# Altium project 100861_project.prjpcb
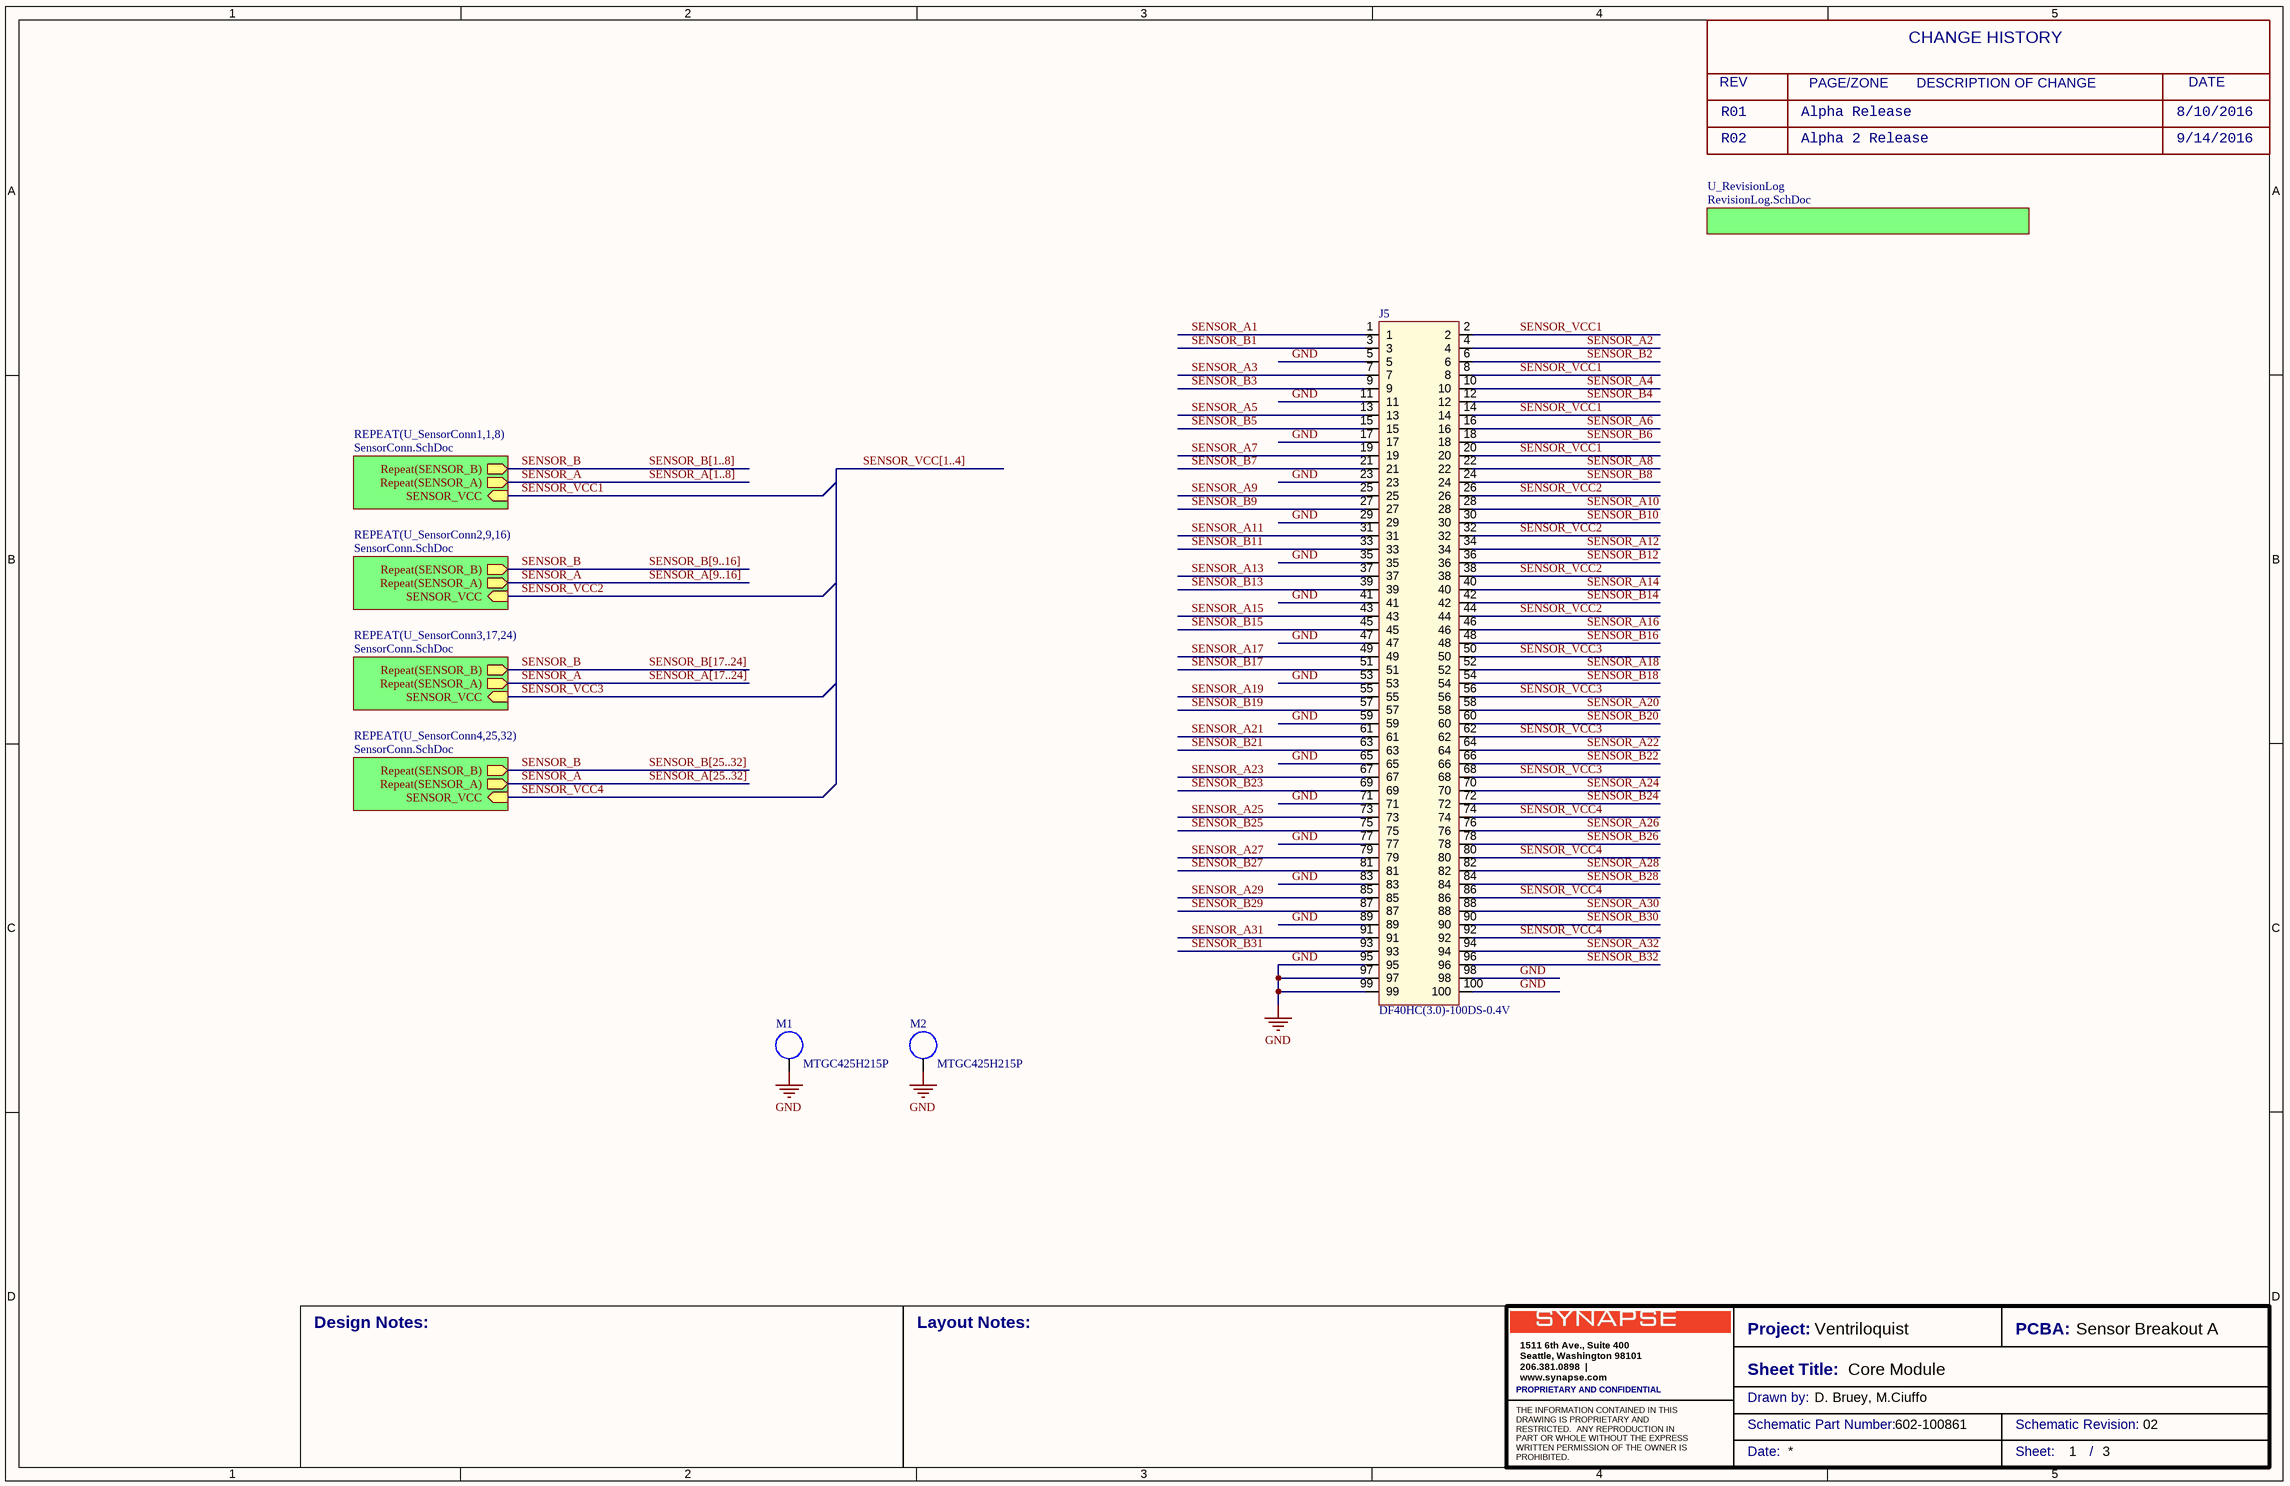
[diagram p0: SensorBreakout.SchDoc]
Board_Name: Sensor Breakout A; Board_Number: 100861; PCB_Revision: 02; Project_Name: Ventriloquist; Sch_Revision: 02
3 sheets, 99 parts. Net scope: hierarchical (ports join the sheet entries above them; power ports are global).
Board file: 100861.PcbDoc
Sheets:
  SensorBreakout.SchDoc
    U_SensorConn11 = SensorConn.SchDoc
    U_SensorConn12 = SensorConn.SchDoc
    U_SensorConn13 = SensorConn.SchDoc
    U_SensorConn14 = SensorConn.SchDoc
    U_SensorConn15 = SensorConn.SchDoc
    U_SensorConn16 = SensorConn.SchDoc
    U_SensorConn17 = SensorConn.SchDoc
    U_SensorConn18 = SensorConn.SchDoc
    U_SensorConn29 = SensorConn.SchDoc
    U_SensorConn210 = SensorConn.SchDoc
    U_SensorConn211 = SensorConn.SchDoc
    U_SensorConn212 = SensorConn.SchDoc
    U_SensorConn213 = SensorConn.SchDoc
    U_SensorConn214 = SensorConn.SchDoc
    U_SensorConn215 = SensorConn.SchDoc
    U_SensorConn216 = SensorConn.SchDoc
    U_SensorConn317 = SensorConn.SchDoc
    U_SensorConn318 = SensorConn.SchDoc
    U_SensorConn319 = SensorConn.SchDoc
    U_SensorConn320 = SensorConn.SchDoc
    U_SensorConn321 = SensorConn.SchDoc
    U_SensorConn322 = SensorConn.SchDoc
    U_SensorConn323 = SensorConn.SchDoc
    U_SensorConn324 = SensorConn.SchDoc
    U_SensorConn425 = SensorConn.SchDoc
    U_SensorConn426 = SensorConn.SchDoc
    U_SensorConn427 = SensorConn.SchDoc
    U_SensorConn428 = SensorConn.SchDoc
    U_SensorConn429 = SensorConn.SchDoc
    U_SensorConn430 = SensorConn.SchDoc
    U_SensorConn431 = SensorConn.SchDoc
    U_SensorConn432 = SensorConn.SchDoc
    U_RevisionLog = RevisionLog.SchDoc

## Sheet SensorBreakout.SchDoc: Core Module
size 431 x 279 mm; DrawnBy: D. Bruey, M.Ciuffo; Organization: Synapse Product Development, LLC.; Address1: 1511 6th Ave., Suite 400; Address2: Seattle, Washington 98101; Address3: 206.381.0898; Address4: www.synapse.com; DocumentNumber: 1; SheetNumber: 1; SheetTotal: 3; PageSetup: Record=PageOptions|CenterHorizontal=True|CenterVertical=True|PrintScale=1.06|XCorrection=1.00|YCorrection=1.00|PrintKind=1|BorderSize=5000000|LeftOffset=0|BottomOffset=0|Orientation=2|PaperLength=4318|PaperWidth=2794|Scale=100|PaperSource=7|PrintQuality=200|MediaType=1|DitherType=10|PrintScaleMode=1|PaperKind=11x17|PaperIndex=3

### Parts
J5  DF40HC(3.0)-100DS-0.4V  [con100_hirose-df40c-100ds_129h]
M1  MTGC425H215P  [MTGC425H215P]  (no BOM)
M2  MTGC425H215P  [MTGC425H215P]  (no BOM)

### Sub-sheets
REPEAT(U_SensorConn1,1,8) = SensorConn.SchDoc: Repeat(SENSOR_A), Repeat(SENSOR_B), SENSOR_VCC (in)
REPEAT(U_SensorConn2,9,16) = SensorConn.SchDoc: Repeat(SENSOR_A), Repeat(SENSOR_B), SENSOR_VCC (in)
REPEAT(U_SensorConn3,17,24) = SensorConn.SchDoc: Repeat(SENSOR_A), Repeat(SENSOR_B), SENSOR_VCC (in)
REPEAT(U_SensorConn4,25,32) = SensorConn.SchDoc: Repeat(SENSOR_A), Repeat(SENSOR_B), SENSOR_VCC (in)
U_RevisionLog = RevisionLog.SchDoc: no entries

### Nets
GND: J5.5 J5.11 J5.17 J5.23 J5.29 J5.35 J5.41 J5.47 J5.53 J5.59 J5.65 J5.71 J5.77 J5.83 J5.89 J5.95 J5.97 J5.98 J5.99 J5.100 M1.1 M2.1
SENSOR_A: sheet REPEAT(U_SensorConn1,1,8)/Repeat(SENSOR_A), sheet REPEAT(U_SensorConn2,9,16)/Repeat(SENSOR_A), sheet REPEAT(U_SensorConn3,17,24)/Repeat(SENSOR_A), sheet REPEAT(U_SensorConn4,25,32)/Repeat(SENSOR_A)
SENSOR_A1: J5.1
SENSOR_A2: J5.4
SENSOR_A3: J5.7
SENSOR_A4: J5.10
SENSOR_A5: J5.13
SENSOR_A6: J5.16
SENSOR_A7: J5.19
SENSOR_A8: J5.22
SENSOR_A9: J5.25
SENSOR_A10: J5.28
SENSOR_A11: J5.31
SENSOR_A12: J5.34
SENSOR_A13: J5.37
SENSOR_A14: J5.40
SENSOR_A15: J5.43
SENSOR_A16: J5.46
SENSOR_A17: J5.49
SENSOR_A18: J5.52
SENSOR_A19: J5.55
SENSOR_A20: J5.58
SENSOR_A21: J5.61
SENSOR_A22: J5.64
SENSOR_A23: J5.67
SENSOR_A24: J5.70
SENSOR_A25: J5.73
SENSOR_A26: J5.76
SENSOR_A27: J5.79
SENSOR_A28: J5.82
SENSOR_A29: J5.85
SENSOR_A30: J5.88
SENSOR_A31: J5.91
SENSOR_A32: J5.94
SENSOR_B: sheet REPEAT(U_SensorConn1,1,8)/Repeat(SENSOR_B), sheet REPEAT(U_SensorConn2,9,16)/Repeat(SENSOR_B), sheet REPEAT(U_SensorConn3,17,24)/Repeat(SENSOR_B), sheet REPEAT(U_SensorConn4,25,32)/Repeat(SENSOR_B)
SENSOR_B1: J5.3
SENSOR_B2: J5.6
SENSOR_B3: J5.9
SENSOR_B4: J5.12
SENSOR_B5: J5.15
SENSOR_B6: J5.18
SENSOR_B7: J5.21
SENSOR_B8: J5.24
SENSOR_B9: J5.27
SENSOR_B10: J5.30
SENSOR_B11: J5.33
SENSOR_B12: J5.36
SENSOR_B13: J5.39
SENSOR_B14: J5.42
SENSOR_B15: J5.45
SENSOR_B16: J5.48
SENSOR_B17: J5.51
SENSOR_B18: J5.54
SENSOR_B19: J5.57
SENSOR_B20: J5.60
SENSOR_B21: J5.63
SENSOR_B22: J5.66
SENSOR_B23: J5.69
SENSOR_B24: J5.72
SENSOR_B25: J5.75
SENSOR_B26: J5.78
SENSOR_B27: J5.81
SENSOR_B28: J5.84
SENSOR_B29: J5.87
SENSOR_B30: J5.90
SENSOR_B31: J5.93
SENSOR_B32: J5.96
SENSOR_VCC1: J5.2 J5.8 J5.14 J5.20 ; sheet REPEAT(U_SensorConn1,1,8)/SENSOR_VCC
SENSOR_VCC2: J5.26 J5.32 J5.38 J5.44 ; sheet REPEAT(U_SensorConn2,9,16)/SENSOR_VCC
SENSOR_VCC3: J5.50 J5.56 J5.62 J5.68 ; sheet REPEAT(U_SensorConn3,17,24)/SENSOR_VCC
SENSOR_VCC4: J5.74 J5.80 J5.86 J5.92 ; sheet REPEAT(U_SensorConn4,25,32)/SENSOR_VCC

### Buses and harness runs
bus SENSOR_A[1..8]
bus SENSOR_A[9..16]
bus SENSOR_A[17..24]
bus SENSOR_A[25..32]
bus SENSOR_B[1..8]
bus SENSOR_B[9..16]
bus SENSOR_B[17..24]
bus SENSOR_B[25..32]
bus SENSOR_VCC[1..4]

### Notes on the sheet
- REV
- PAGE/ZONE       DESCRIPTION OF CHANGE
- CHANGE HISTORY
- DATE
- R01
- R02
- Alpha Release
- Alpha 2 Release
- 8/10/2016
- 9/14/2016
- Design Notes:
- Layout Notes:
- Project:
- Sheet Title:
- PCBA:
- PROPRIETARY AND CONFIDENTIAL
- Drawn by:
- Schematic Part Number:
- Schematic Revision:
- Date:
- Sheet:
- /

### Library data of the parts
J5 = DF40HC(3.0)-100DS-0.4V(51): CONN RCPT 100POS 0.4MM SMD GOLD 3.0MM; part_type: connector; id: 1590; mfg: Hirose; dist: Mouser; dist_pn: 798-DF40HC30100DS451; voltage: 30V; positions: 100; TableName: viewAltiumConnectors; mfg_pn: DF40HC(3.0)-100DS-0.4V(51); source_package: DF40HC(3.0)-100DS-0.4V(51); height: 3.0mm; status: Unknown; datasheet: http://www.hirose.co.jp/cataloge_hp/ed_DF40_20140305.pdf
M1 M2 = MTGC425H215P: MTG, 4.25mm PAD, 2.15mm Plated Hole; part_type: mounting; id: 1240; dist_pn: None; TableName: viewAltiumMisc; mfg_pn: MTGC425H215P; height: 0.05MM; status: Unknown

## Sheet SensorConn.SchDoc: Sensor Connectors
size 431 x 279 mm; DrawnBy: D. Bruey, M. Ciuffo; Organization: Synapse Product Development, LLC.; Address1: 1511 6th Ave., Suite 400; Address2: Seattle, Washington 98101; Address3: 206.381.0898; Address4: www.synapse.com; DocumentNumber: 2; SheetNumber: 2; SheetTotal: 3; PageSetup: Record=PageOptions|CenterHorizontal=True|CenterVertical=True|PrintScale=1.06|XCorrection=1.00|YCorrection=1.00|PrintKind=1|BorderSize=5000000|LeftOffset=0|BottomOffset=0|Orientation=2|PaperLength=4318|PaperWidth=2794|Scale=100|PaperSource=7|PrintQuality=200|MediaType=1|DitherType=10|PrintScaleMode=1|PaperKind=11x17|PaperIndex=3
Used 32 times, as channels U_SensorConn11, U_SensorConn12, U_SensorConn13, U_SensorConn14, U_SensorConn15, U_SensorConn16, U_SensorConn17, U_SensorConn18, U_SensorConn29, U_SensorConn210, U_SensorConn211, U_SensorConn212, U_SensorConn213, U_SensorConn214, U_SensorConn215, U_SensorConn216, U_SensorConn317, U_SensorConn318, U_SensorConn319, U_SensorConn320, U_SensorConn321, U_SensorConn322, U_SensorConn323, U_SensorConn324, U_SensorConn425, U_SensorConn426, U_SensorConn427, U_SensorConn428, U_SensorConn429, U_SensorConn430, U_SensorConn431, U_SensorConn432. Parts and nets are listed once, with the designators drawn on the sheet.
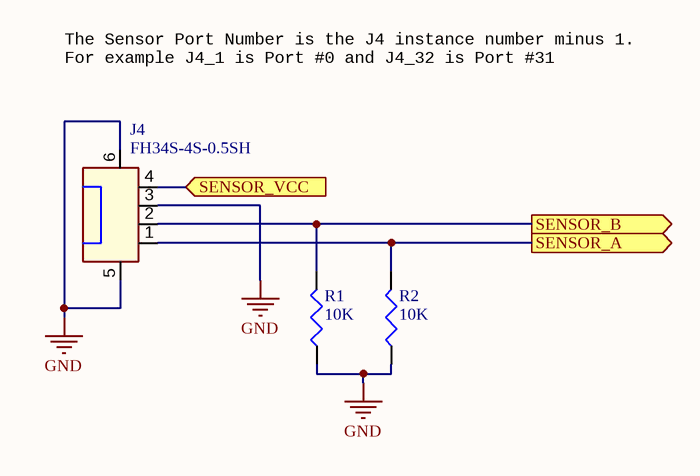
[diagram p1: SensorConn.SchDoc]

### Parts
J4  FH34S-4S-0.5SH  [con_hirose_FH34SRJ-4S]
R1  10K  [0402-IPCsm_40]
R2  10K  [0402-IPCsm_40]

### Ports
SENSOR_A (out), SENSOR_B (out), SENSOR_VCC (in)

### Nets
GND: J4.3 J4.5(TAB1) J4.6(TAB2) R1.1 R2.1
SENSOR_A: J4.1 R2.2 ; port SENSOR_A
SENSOR_B: J4.2 R1.2 ; port SENSOR_B
SENSOR_VCC: J4.4 ; port SENSOR_VCC

### Channels
U_SensorConn11: designators end in _1; ports SENSOR_A=SENSOR_A1 SENSOR_B=SENSOR_B1 SENSOR_VCC=SENSOR_VCC1
U_SensorConn12: designators end in _2; ports SENSOR_A=SENSOR_A2 SENSOR_B=SENSOR_B2 SENSOR_VCC=SENSOR_VCC1
U_SensorConn13: designators end in _3; ports SENSOR_A=SENSOR_A3 SENSOR_B=SENSOR_B3 SENSOR_VCC=SENSOR_VCC1
U_SensorConn14: designators end in _4; ports SENSOR_A=SENSOR_A4 SENSOR_B=SENSOR_B4 SENSOR_VCC=SENSOR_VCC1
U_SensorConn15: designators end in _5; ports SENSOR_A=SENSOR_A5 SENSOR_B=SENSOR_B5 SENSOR_VCC=SENSOR_VCC1
U_SensorConn16: designators end in _6; ports SENSOR_A=SENSOR_A6 SENSOR_B=SENSOR_B6 SENSOR_VCC=SENSOR_VCC1
U_SensorConn17: designators end in _7; ports SENSOR_A=SENSOR_A7 SENSOR_B=SENSOR_B7 SENSOR_VCC=SENSOR_VCC1
U_SensorConn18: designators end in _8; ports SENSOR_A=SENSOR_A8 SENSOR_B=SENSOR_B8 SENSOR_VCC=SENSOR_VCC1
U_SensorConn29: designators end in _9; ports SENSOR_A=SENSOR_A9 SENSOR_B=SENSOR_B9 SENSOR_VCC=SENSOR_VCC2
U_SensorConn210: designators end in _10; ports SENSOR_A=SENSOR_A10 SENSOR_B=SENSOR_B10 SENSOR_VCC=SENSOR_VCC2
U_SensorConn211: designators end in _11; ports SENSOR_A=SENSOR_A11 SENSOR_B=SENSOR_B11 SENSOR_VCC=SENSOR_VCC2
U_SensorConn212: designators end in _12; ports SENSOR_A=SENSOR_A12 SENSOR_B=SENSOR_B12 SENSOR_VCC=SENSOR_VCC2
U_SensorConn213: designators end in _13; ports SENSOR_A=SENSOR_A13 SENSOR_B=SENSOR_B13 SENSOR_VCC=SENSOR_VCC2
U_SensorConn214: designators end in _14; ports SENSOR_A=SENSOR_A14 SENSOR_B=SENSOR_B14 SENSOR_VCC=SENSOR_VCC2
U_SensorConn215: designators end in _15; ports SENSOR_A=SENSOR_A15 SENSOR_B=SENSOR_B15 SENSOR_VCC=SENSOR_VCC2
U_SensorConn216: designators end in _16; ports SENSOR_A=SENSOR_A16 SENSOR_B=SENSOR_B16 SENSOR_VCC=SENSOR_VCC2
U_SensorConn317: designators end in _17; ports SENSOR_A=SENSOR_A17 SENSOR_B=SENSOR_B17 SENSOR_VCC=SENSOR_VCC3
U_SensorConn318: designators end in _18; ports SENSOR_A=SENSOR_A18 SENSOR_B=SENSOR_B18 SENSOR_VCC=SENSOR_VCC3
U_SensorConn319: designators end in _19; ports SENSOR_A=SENSOR_A19 SENSOR_B=SENSOR_B19 SENSOR_VCC=SENSOR_VCC3
U_SensorConn320: designators end in _20; ports SENSOR_A=SENSOR_A20 SENSOR_B=SENSOR_B20 SENSOR_VCC=SENSOR_VCC3
U_SensorConn321: designators end in _21; ports SENSOR_A=SENSOR_A21 SENSOR_B=SENSOR_B21 SENSOR_VCC=SENSOR_VCC3
U_SensorConn322: designators end in _22; ports SENSOR_A=SENSOR_A22 SENSOR_B=SENSOR_B22 SENSOR_VCC=SENSOR_VCC3
U_SensorConn323: designators end in _23; ports SENSOR_A=SENSOR_A23 SENSOR_B=SENSOR_B23 SENSOR_VCC=SENSOR_VCC3
U_SensorConn324: designators end in _24; ports SENSOR_A=SENSOR_A24 SENSOR_B=SENSOR_B24 SENSOR_VCC=SENSOR_VCC3
U_SensorConn425: designators end in _25; ports SENSOR_A=SENSOR_A25 SENSOR_B=SENSOR_B25 SENSOR_VCC=SENSOR_VCC4
U_SensorConn426: designators end in _26; ports SENSOR_A=SENSOR_A26 SENSOR_B=SENSOR_B26 SENSOR_VCC=SENSOR_VCC4
U_SensorConn427: designators end in _27; ports SENSOR_A=SENSOR_A27 SENSOR_B=SENSOR_B27 SENSOR_VCC=SENSOR_VCC4
U_SensorConn428: designators end in _28; ports SENSOR_A=SENSOR_A28 SENSOR_B=SENSOR_B28 SENSOR_VCC=SENSOR_VCC4
U_SensorConn429: designators end in _29; ports SENSOR_A=SENSOR_A29 SENSOR_B=SENSOR_B29 SENSOR_VCC=SENSOR_VCC4
U_SensorConn430: designators end in _30; ports SENSOR_A=SENSOR_A30 SENSOR_B=SENSOR_B30 SENSOR_VCC=SENSOR_VCC4
U_SensorConn431: designators end in _31; ports SENSOR_A=SENSOR_A31 SENSOR_B=SENSOR_B31 SENSOR_VCC=SENSOR_VCC4
U_SensorConn432: designators end in _32; ports SENSOR_A=SENSOR_A32 SENSOR_B=SENSOR_B32 SENSOR_VCC=SENSOR_VCC4

### Notes on the sheet
- The Sensor Port Number is the J4 instance number minus 1.
  For example J4_1 is Port #0 and J4_32 is Port #31
- Design Notes:
- Layout Notes:
- Project:
- Sheet Title:
- PCBA:
- PROPRIETARY AND CONFIDENTIAL
- Drawn by:
- Schematic Part Number:
- Schematic Revision:
- Date:
- Sheet:
- /

### Library data of the parts
J4 = FH34S-4S-0.5SH: CONN FFC FPC 4POS 0.50MM R/A; part_type: ffc/fpc; id: 1604; mfg: HIROSE; dist: MOUSER; dist_pn: 798-FH34S-4S-0.5SH50; symbol: \\synapsedev.com\dfs\FS\EE_STUFF\CAD_LIB\MASTER\MASTER_CON\HEADER 4 TABS; positions: 4; layout_notes: Top Contacts; OrCADSymbol: MASTER_CON\HEADER 4 TABS; TableName: viewAltiumConnectors; mfg_pn: FH34S-4S-0.5SH; allegro_footprint: con_hirose_FH34SRJ-4S; height: 1.1mm; status: Unknown; SymbolPath: C:\EE-Vault\Libraries\Schematic\MASTER_CON\HEADER 4 TABS
R1 R2 = RC0402JR-0710KL: RES 10.0K OHM 1/16W 5% 0402 SMD; part_type: resistor; Allegro_footprint: 0402-IPCsm_40,r-0402_16H; Tolerance: 5.00%; Voltage: 50V; DIST: DIGIKEY; MFG: YAGEO AMERICA; DIST_PN: 311-10KJRCT-ND; Power: 0.063W; id: 1219; symbol: \\synapsedev.com\dfs\FS\EE_STUFF\CAD_LIB\MASTER\MASTER_DISCRETE\RES; source_package: R_10K_5P_0402; OrCADSymbol: MASTER_DISCRETE\RES; TableName: viewAltiumResistors; Height: .4MM; MFG_PN: RC0402JR-0710KL; status: Unknown; SymbolPath: C:\EE-Vault\Libraries\Schematic\MASTER_DISCRETE\RES

## Sheet RevisionLog.SchDoc: Revision Log
size 431 x 279 mm; DrawnBy: D. Bruey, M.Ciuffo; Organization: Synapse Product Development, LLC.; Address1: 1511 6th Ave., Suite 400; Address2: Seattle, Washington 98101; Address3: 206.381.0898; Address4: www.synapse.com; DocumentNumber: 3; SheetNumber: 3; SheetTotal: 3; PageSetup: Record=PageOptions|CenterHorizontal=True|CenterVertical=True|PrintScale=1.06|XCorrection=1.00|YCorrection=1.00|PrintKind=1|BorderSize=5000000|LeftOffset=0|BottomOffset=0|Orientation=2|PaperLength=4318|PaperWidth=2794|Scale=100|PaperSource=7|PrintQuality=200|MediaType=1|DitherType=10|PrintScaleMode=1|PaperKind=11x17|PaperIndex=3
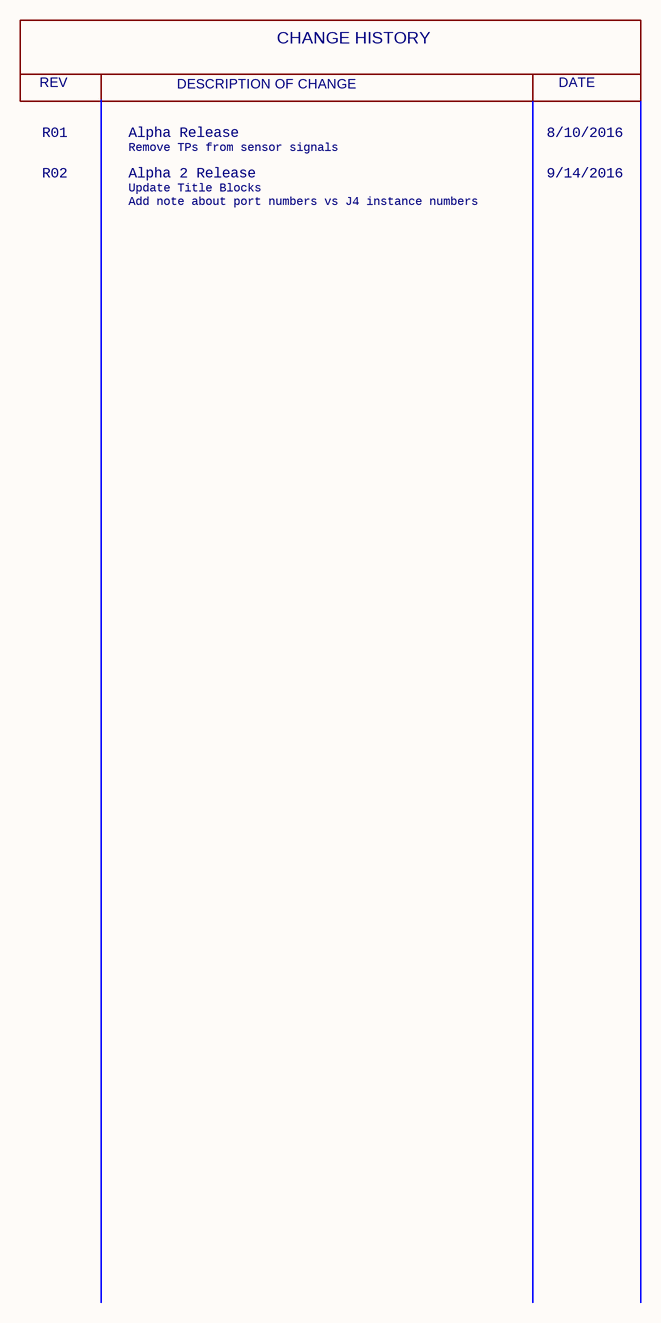
[diagram p2: RevisionLog.SchDoc]

### Notes on the sheet
- REV
- DESCRIPTION OF CHANGE
- CHANGE HISTORY
- DATE
- R01
- Alpha Release
- Remove TPs from sensor signals
- 8/10/2016
- R02
- Alpha 2 Release
- Update Title Blocks
- Add note about port numbers vs J4 instance numbers
- 9/14/2016
- Design Notes:
- Layout Notes:
- Project:
- Sheet Title:
- PCBA:
- PROPRIETARY AND CONFIDENTIAL
- Drawn by:
- Schematic Part Number:
- Schematic Revision:
- Date:
- Sheet:
- /

## Nets that join several sheets
GND: SensorBreakout (22 pins), U_SensorConn11 (5 pins), U_SensorConn12 (5 pins), U_SensorConn13 (5 pins), U_SensorConn14 (5 pins), U_SensorConn15 (5 pins), U_SensorConn16 (5 pins), U_SensorConn17 (5 pins), U_SensorConn18 (5 pins), U_SensorConn29 (5 pins), U_SensorConn210 (5 pins), U_SensorConn211 (5 pins), U_SensorConn212 (5 pins), U_SensorConn213 (5 pins), U_SensorConn214 (5 pins), U_SensorConn215 (5 pins), U_SensorConn216 (5 pins), U_SensorConn317 (5 pins), U_SensorConn318 (5 pins), U_SensorConn319 (5 pins), U_SensorConn320 (5 pins), U_SensorConn321 (5 pins), U_SensorConn322 (5 pins), U_SensorConn323 (5 pins), U_SensorConn324 (5 pins), U_SensorConn425 (5 pins), U_SensorConn426 (5 pins), U_SensorConn427 (5 pins), U_SensorConn428 (5 pins), U_SensorConn429 (5 pins), U_SensorConn430 (5 pins), U_SensorConn431 (5 pins), U_SensorConn432 (5 pins)
SENSOR_A1: SensorBreakout (J5.1), U_SensorConn11 (J4_1.1 R2_1.2)
SENSOR_A2: SensorBreakout (J5.4), U_SensorConn12 (J4_2.1 R2_2.2)
SENSOR_A3: SensorBreakout (J5.7), U_SensorConn13 (J4_3.1 R2_3.2)
SENSOR_A4: SensorBreakout (J5.10), U_SensorConn14 (J4_4.1 R2_4.2)
SENSOR_A5: SensorBreakout (J5.13), U_SensorConn15 (J4_5.1 R2_5.2)
SENSOR_A6: SensorBreakout (J5.16), U_SensorConn16 (J4_6.1 R2_6.2)
SENSOR_A7: SensorBreakout (J5.19), U_SensorConn17 (J4_7.1 R2_7.2)
SENSOR_A8: SensorBreakout (J5.22), U_SensorConn18 (J4_8.1 R2_8.2)
SENSOR_A9: SensorBreakout (J5.25), U_SensorConn29 (J4_9.1 R2_9.2)
SENSOR_A10: SensorBreakout (J5.28), U_SensorConn210 (J4_10.1 R2_10.2)
SENSOR_A11: SensorBreakout (J5.31), U_SensorConn211 (J4_11.1 R2_11.2)
SENSOR_A12: SensorBreakout (J5.34), U_SensorConn212 (J4_12.1 R2_12.2)
SENSOR_A13: SensorBreakout (J5.37), U_SensorConn213 (J4_13.1 R2_13.2)
SENSOR_A14: SensorBreakout (J5.40), U_SensorConn214 (J4_14.1 R2_14.2)
SENSOR_A15: SensorBreakout (J5.43), U_SensorConn215 (J4_15.1 R2_15.2)
SENSOR_A16: SensorBreakout (J5.46), U_SensorConn216 (J4_16.1 R2_16.2)
SENSOR_A17: SensorBreakout (J5.49), U_SensorConn317 (J4_17.1 R2_17.2)
SENSOR_A18: SensorBreakout (J5.52), U_SensorConn318 (J4_18.1 R2_18.2)
SENSOR_A19: SensorBreakout (J5.55), U_SensorConn319 (J4_19.1 R2_19.2)
SENSOR_A20: SensorBreakout (J5.58), U_SensorConn320 (J4_20.1 R2_20.2)
SENSOR_A21: SensorBreakout (J5.61), U_SensorConn321 (J4_21.1 R2_21.2)
SENSOR_A22: SensorBreakout (J5.64), U_SensorConn322 (J4_22.1 R2_22.2)
SENSOR_A23: SensorBreakout (J5.67), U_SensorConn323 (J4_23.1 R2_23.2)
SENSOR_A24: SensorBreakout (J5.70), U_SensorConn324 (J4_24.1 R2_24.2)
SENSOR_A25: SensorBreakout (J5.73), U_SensorConn425 (J4_25.1 R2_25.2)
SENSOR_A26: SensorBreakout (J5.76), U_SensorConn426 (J4_26.1 R2_26.2)
SENSOR_A27: SensorBreakout (J5.79), U_SensorConn427 (J4_27.1 R2_27.2)
SENSOR_A28: SensorBreakout (J5.82), U_SensorConn428 (J4_28.1 R2_28.2)
SENSOR_A29: SensorBreakout (J5.85), U_SensorConn429 (J4_29.1 R2_29.2)
SENSOR_A30: SensorBreakout (J5.88), U_SensorConn430 (J4_30.1 R2_30.2)
SENSOR_A31: SensorBreakout (J5.91), U_SensorConn431 (J4_31.1 R2_31.2)
SENSOR_A32: SensorBreakout (J5.94), U_SensorConn432 (J4_32.1 R2_32.2)
SENSOR_B1: SensorBreakout (J5.3), U_SensorConn11 (J4_1.2 R1_1.2)
SENSOR_B2: SensorBreakout (J5.6), U_SensorConn12 (J4_2.2 R1_2.2)
SENSOR_B3: SensorBreakout (J5.9), U_SensorConn13 (J4_3.2 R1_3.2)
SENSOR_B4: SensorBreakout (J5.12), U_SensorConn14 (J4_4.2 R1_4.2)
SENSOR_B5: SensorBreakout (J5.15), U_SensorConn15 (J4_5.2 R1_5.2)
SENSOR_B6: SensorBreakout (J5.18), U_SensorConn16 (J4_6.2 R1_6.2)
SENSOR_B7: SensorBreakout (J5.21), U_SensorConn17 (J4_7.2 R1_7.2)
SENSOR_B8: SensorBreakout (J5.24), U_SensorConn18 (J4_8.2 R1_8.2)
SENSOR_B9: SensorBreakout (J5.27), U_SensorConn29 (J4_9.2 R1_9.2)
SENSOR_B10: SensorBreakout (J5.30), U_SensorConn210 (J4_10.2 R1_10.2)
SENSOR_B11: SensorBreakout (J5.33), U_SensorConn211 (J4_11.2 R1_11.2)
SENSOR_B12: SensorBreakout (J5.36), U_SensorConn212 (J4_12.2 R1_12.2)
SENSOR_B13: SensorBreakout (J5.39), U_SensorConn213 (J4_13.2 R1_13.2)
SENSOR_B14: SensorBreakout (J5.42), U_SensorConn214 (J4_14.2 R1_14.2)
SENSOR_B15: SensorBreakout (J5.45), U_SensorConn215 (J4_15.2 R1_15.2)
SENSOR_B16: SensorBreakout (J5.48), U_SensorConn216 (J4_16.2 R1_16.2)
SENSOR_B17: SensorBreakout (J5.51), U_SensorConn317 (J4_17.2 R1_17.2)
SENSOR_B18: SensorBreakout (J5.54), U_SensorConn318 (J4_18.2 R1_18.2)
SENSOR_B19: SensorBreakout (J5.57), U_SensorConn319 (J4_19.2 R1_19.2)
SENSOR_B20: SensorBreakout (J5.60), U_SensorConn320 (J4_20.2 R1_20.2)
SENSOR_B21: SensorBreakout (J5.63), U_SensorConn321 (J4_21.2 R1_21.2)
SENSOR_B22: SensorBreakout (J5.66), U_SensorConn322 (J4_22.2 R1_22.2)
SENSOR_B23: SensorBreakout (J5.69), U_SensorConn323 (J4_23.2 R1_23.2)
SENSOR_B24: SensorBreakout (J5.72), U_SensorConn324 (J4_24.2 R1_24.2)
SENSOR_B25: SensorBreakout (J5.75), U_SensorConn425 (J4_25.2 R1_25.2)
SENSOR_B26: SensorBreakout (J5.78), U_SensorConn426 (J4_26.2 R1_26.2)
SENSOR_B27: SensorBreakout (J5.81), U_SensorConn427 (J4_27.2 R1_27.2)
SENSOR_B28: SensorBreakout (J5.84), U_SensorConn428 (J4_28.2 R1_28.2)
SENSOR_B29: SensorBreakout (J5.87), U_SensorConn429 (J4_29.2 R1_29.2)
SENSOR_B30: SensorBreakout (J5.90), U_SensorConn430 (J4_30.2 R1_30.2)
SENSOR_B31: SensorBreakout (J5.93), U_SensorConn431 (J4_31.2 R1_31.2)
SENSOR_B32: SensorBreakout (J5.96), U_SensorConn432 (J4_32.2 R1_32.2)
SENSOR_VCC1: SensorBreakout (J5.2 J5.8 J5.14 J5.20), U_SensorConn11 (J4_1.4), U_SensorConn12 (J4_2.4), U_SensorConn13 (J4_3.4), U_SensorConn14 (J4_4.4), U_SensorConn15 (J4_5.4), U_SensorConn16 (J4_6.4), U_SensorConn17 (J4_7.4), U_SensorConn18 (J4_8.4)
SENSOR_VCC2: SensorBreakout (J5.26 J5.32 J5.38 J5.44), U_SensorConn29 (J4_9.4), U_SensorConn210 (J4_10.4), U_SensorConn211 (J4_11.4), U_SensorConn212 (J4_12.4), U_SensorConn213 (J4_13.4), U_SensorConn214 (J4_14.4), U_SensorConn215 (J4_15.4), U_SensorConn216 (J4_16.4)
SENSOR_VCC3: SensorBreakout (J5.50 J5.56 J5.62 J5.68), U_SensorConn317 (J4_17.4), U_SensorConn318 (J4_18.4), U_SensorConn319 (J4_19.4), U_SensorConn320 (J4_20.4), U_SensorConn321 (J4_21.4), U_SensorConn322 (J4_22.4), U_SensorConn323 (J4_23.4), U_SensorConn324 (J4_24.4)
SENSOR_VCC4: SensorBreakout (J5.74 J5.80 J5.86 J5.92), U_SensorConn425 (J4_25.4), U_SensorConn426 (J4_26.4), U_SensorConn427 (J4_27.4), U_SensorConn428 (J4_28.4), U_SensorConn429 (J4_29.4), U_SensorConn430 (J4_30.4), U_SensorConn431 (J4_31.4), U_SensorConn432 (J4_32.4)

## Assembly variants
100861: not fitted R1_1 R1_2 R1_3 R1_4 R1_5 R1_6 R1_7 R1_8 R1_9 R1_10 R1_11 R1_12 R1_13 R1_14 R1_15 R1_16 R1_17 R1_18 R1_19 R1_20 R1_21 R1_22 R1_23 R1_24 R1_25 R1_26 R1_27 R1_28 R1_29 R1_30 R1_31 R1_32 R2_1 R2_2 R2_3 R2_4 R2_5 R2_6 R2_7 R2_8 R2_9 R2_10 R2_11 R2_12 R2_13 R2_14 R2_15 R2_16 R2_17 R2_18 R2_19 R2_20 R2_21 R2_22 R2_23 R2_24 R2_25 R2_26 R2_27 R2_28 R2_29 R2_30 R2_31 R2_32